# EAGLE schematic lul (EAGLE 9.6.1)
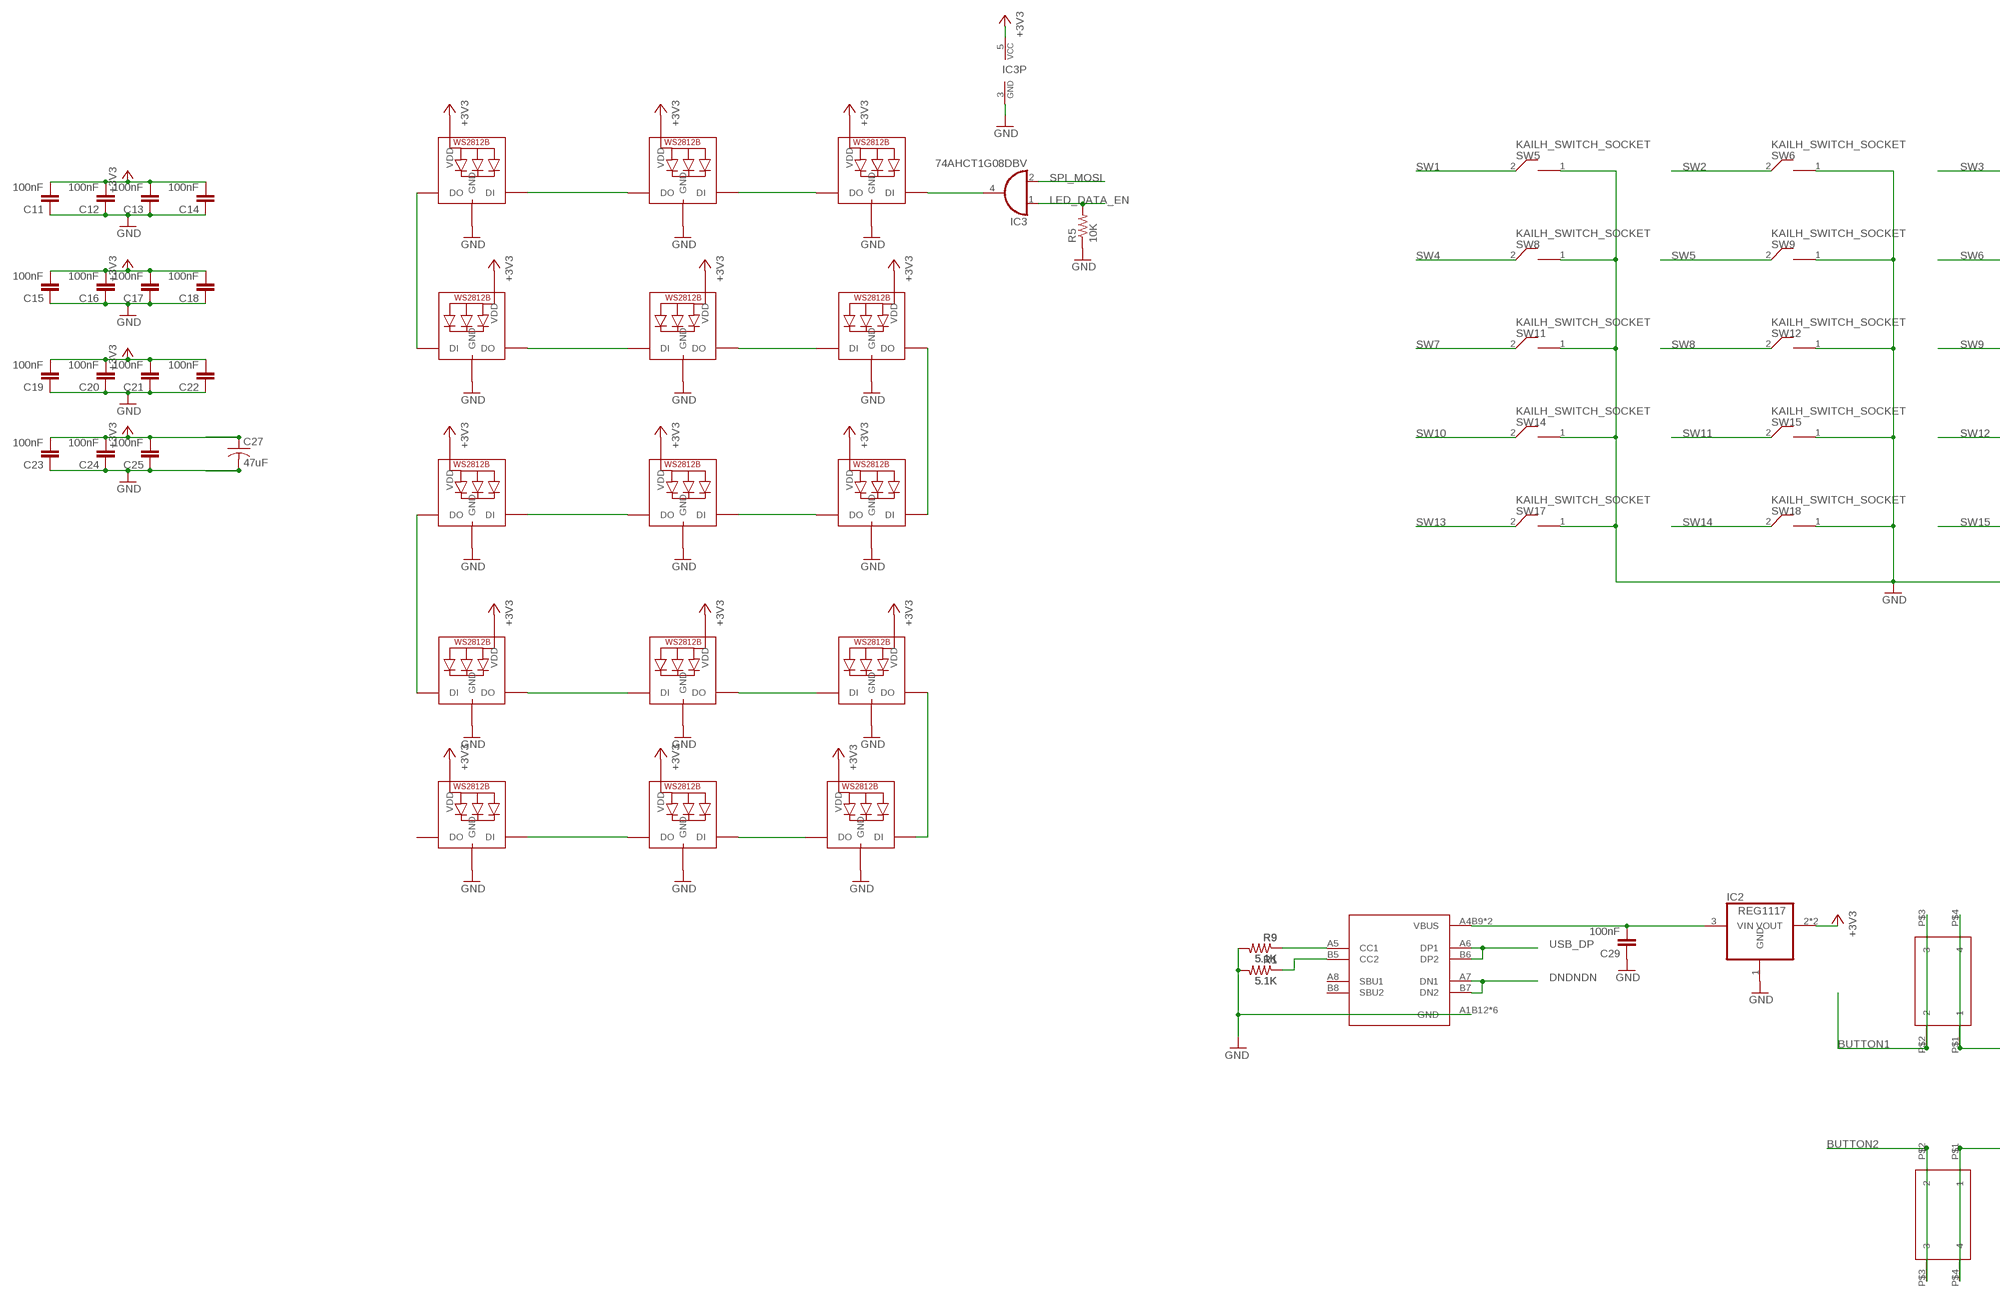
[diagram p0: schematic, sheet 1, part 1 of 2]
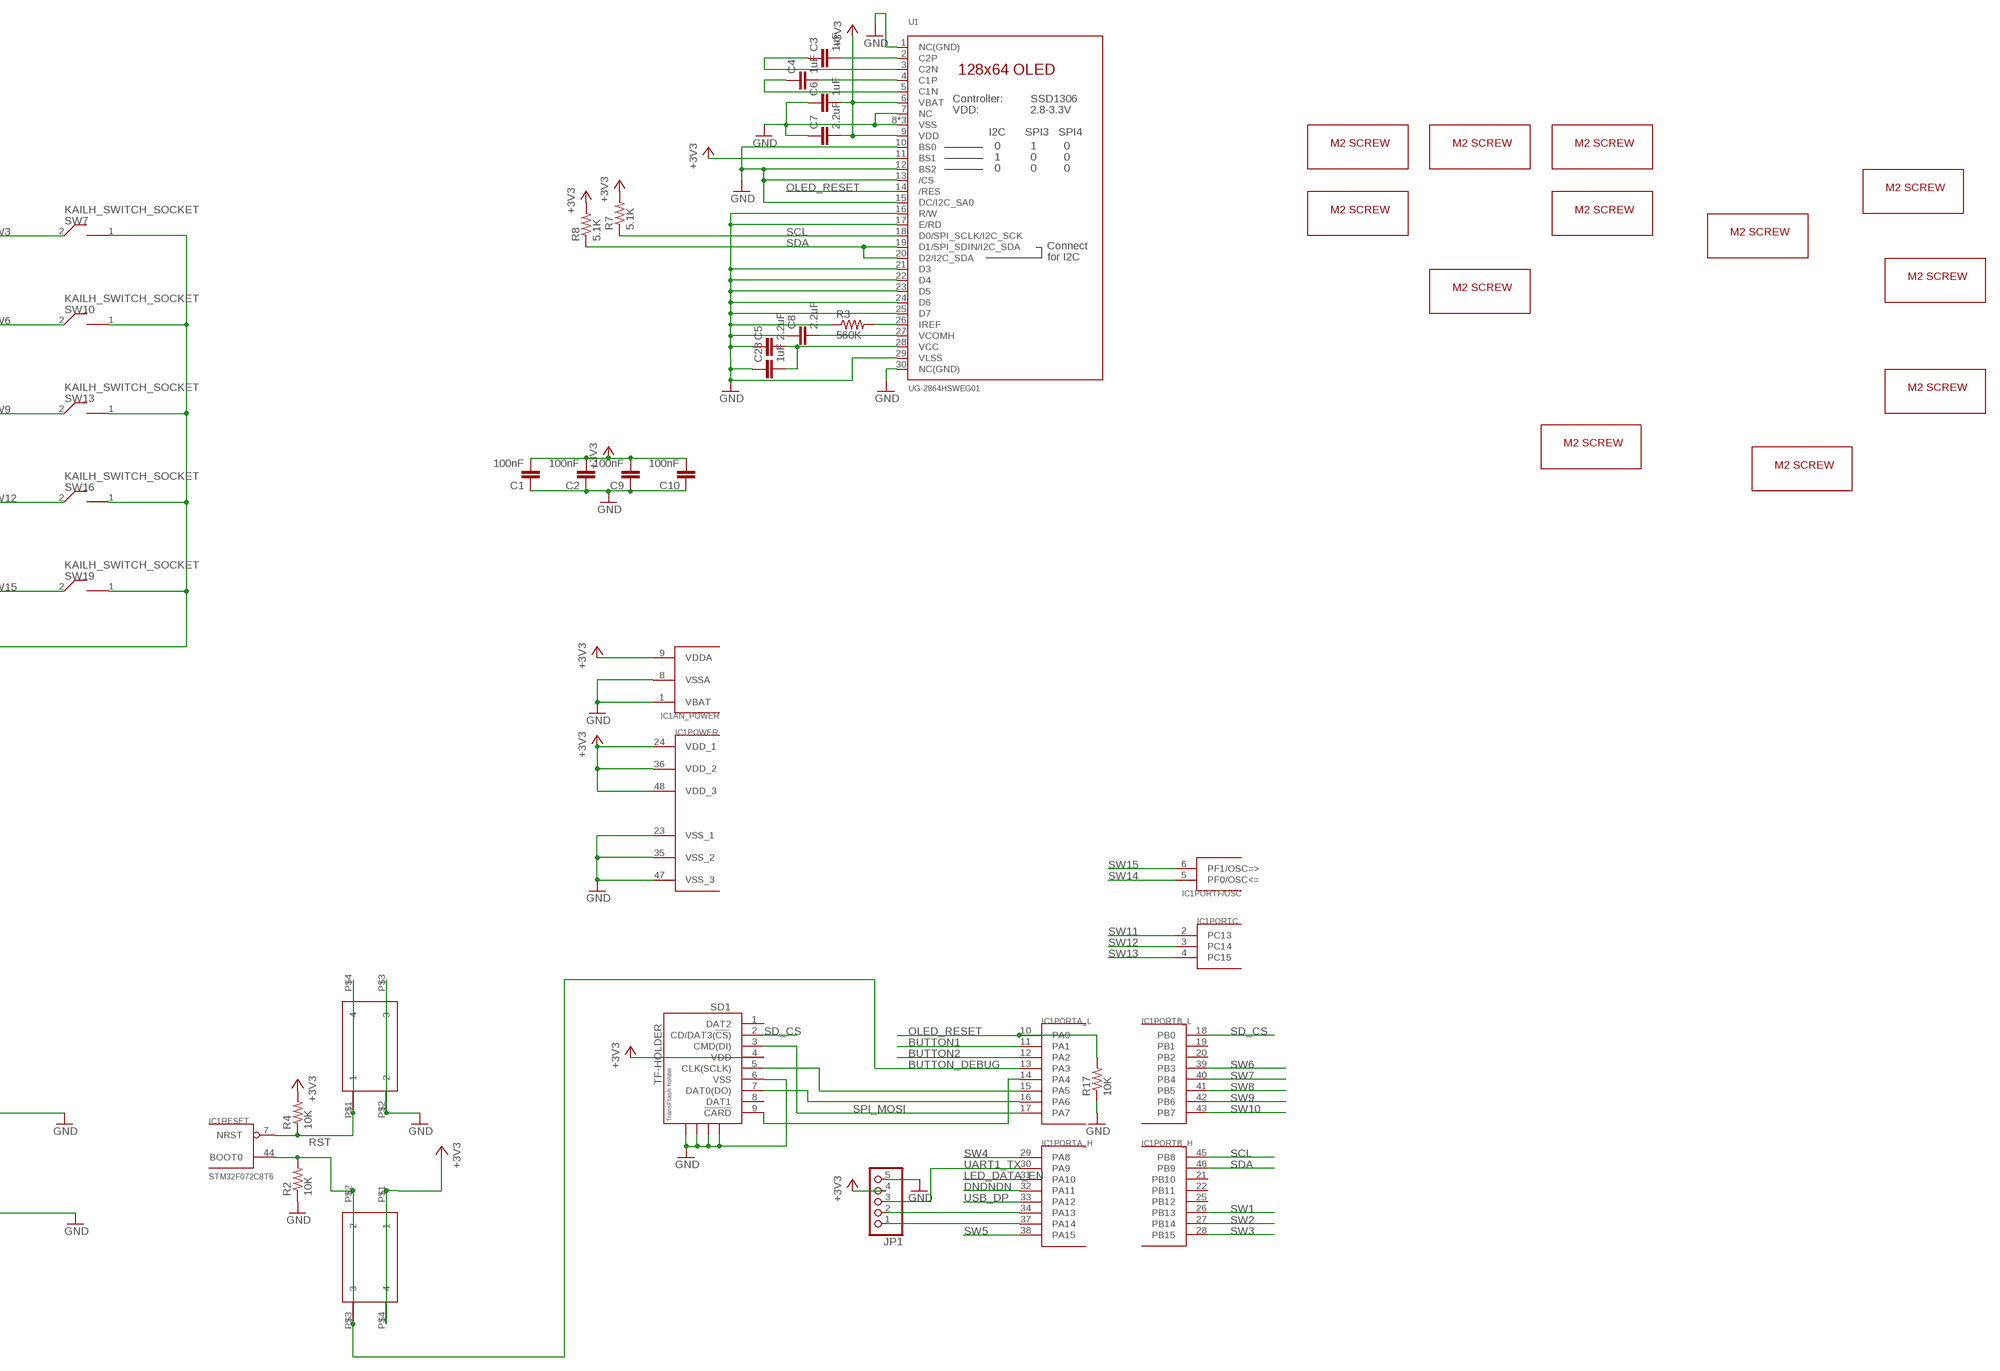
[diagram p1: schematic, sheet 1, part 2 of 2]

## Parts
C1  100nF  CAP0805  [0805@1]
C2  100nF  CAP0805  [0805@1]
C3  1uF  CAP0805  [0805@1]
C4  1uF  CAP0805  [0805@1]
C5  2.2uF  CAP0805  [0805@1]
C6  1uF  CAP0805  [0805@1]
C7  2.2uF  CAP0805  [0805@1]
C8  2.2uF  CAP0805  [0805@1]
C9  100nF  CAP0805  [0805@1]
C10  100nF  CAP0805  [0805@1]
C11  100nF  CAP0805  [0805@1]
C12  100nF  CAP0805  [0805@1]
C13  100nF  CAP0805  [0805@1]
C14  100nF  CAP0805  [0805@1]
C15  100nF  CAP0805  [0805@1]
C16  100nF  CAP0805  [0805@1]
C17  100nF  CAP0805  [0805@1]
C18  100nF  CAP0805  [0805@1]
C19  100nF  CAP0805  [0805@1]
C20  100nF  CAP0805  [0805@1]
C21  100nF  CAP0805  [0805@1]
C22  100nF  CAP0805  [0805@1]
C23  100nF  CAP0805  [0805@1]
C24  100nF  CAP0805  [0805@1]
C25  100nF  CAP0805  [0805@1]
C27  47uF  C-USC1210  [C1210]
C28  1uF  CAP0805  [0805@1]
C29  100nF  CAP0805  [0805@1]
IC1  STM32F072C8T6  [TQFP48]
IC2  REG1117  [SOT223]
IC3  74AHCT1G08DBV  [SOT23-5]
JP1  PINHD-1X5  [1X05]
LED1  WS2812B  [REVERSE_MNT]
LED2  WS2812B  [REVERSE_MNT]
LED3  WS2812B  [REVERSE_MNT]
LED4  WS2812B  [REVERSE_MNT]
LED5  WS2812B  [REVERSE_MNT]
LED6  WS2812B  [REVERSE_MNT]
LED7  WS2812B  [REVERSE_MNT]
LED8  WS2812B  [REVERSE_MNT]
LED9  WS2812B  [REVERSE_MNT]
LED10  WS2812B  [REVERSE_MNT]
LED11  WS2812B  [REVERSE_MNT]
LED12  WS2812B  [REVERSE_MNT]
LED13  WS2812B  [REVERSE_MNT]
LED14  WS2812B  [REVERSE_MNT]
LED15  WS2812B  [REVERSE_MNT]
R1  5.1K  RESISTOR0805-RES  [0805]
R2  10K  RESISTOR0805-RES  [0805]
R3  560K  RESISTOR0805-RES  [0805]
R4  10K  RESISTOR0805-RES  [0805]
R5  10K  RESISTOR0805-RES  [0805]
R7  5.1K  RESISTOR0805-RES  [0805]
R8  5.1K  RESISTOR0805-RES  [0805]
R9  5.1K  RESISTOR0805-RES  [0805]
R17  10K  RESISTOR0805-RES  [0805]
SD1  TF-HOLDER  [TF-PULL]
SW1  324_SW324_SWITCH_FOOT_HOLE  [342_SWICH_FOOT_HOLE]
SW2  324_SW324_SWITCH_FOOT_HOLE  [342_SWICH_FOOT_HOLE]
SW3  324_SW  [342_SWICH_FOOT]
SW4  324_SW  [342_SWICH_FOOT]
SW5  KAILH_SWITCH_SOCKET  [SWITCH_SOCKET]
SW6  KAILH_SWITCH_SOCKET  [SWITCH_SOCKET]
SW7  KAILH_SWITCH_SOCKET  [SWITCH_SOCKET]
SW8  KAILH_SWITCH_SOCKET  [SWITCH_SOCKET]
SW9  KAILH_SWITCH_SOCKET  [SWITCH_SOCKET]
SW10  KAILH_SWITCH_SOCKET  [SWITCH_SOCKET]
SW11  KAILH_SWITCH_SOCKET  [SWITCH_SOCKET]
SW12  KAILH_SWITCH_SOCKET  [SWITCH_SOCKET]
SW13  KAILH_SWITCH_SOCKET  [SWITCH_SOCKET]
SW14  KAILH_SWITCH_SOCKET  [SWITCH_SOCKET]
SW15  KAILH_SWITCH_SOCKET  [SWITCH_SOCKET]
SW16  KAILH_SWITCH_SOCKET  [SWITCH_SOCKET]
SW17  KAILH_SWITCH_SOCKET  [SWITCH_SOCKET]
SW18  KAILH_SWITCH_SOCKET  [SWITCH_SOCKET]
SW19  KAILH_SWITCH_SOCKET  [SWITCH_SOCKET]
U1  UG-2864HSWEG01  LUL_DISP_OLED_UG-2864HSWEG01  [LUL_UG-2864HSWEG01_1.3_WRAPAROUND]
U2  USBC_16P  [USBC_16P_FOOT]
U$7  M2_SCREW_DEV  [M2_SCREW_FOOT]
U$8  M2_SCREW_DEV  [M2_SCREW_FOOT]
U$9  M2_SCREW_DEV  [M2_SCREW_FOOT]
U$10  M2_SCREW_DEV  [M2_SCREW_FOOT]
U$11  M2_SCREW_DEV  [M2_SCREW_FOOT]
U$12  M2_SCREW_DEV  [M2_SCREW_FOOT]
U$13  M2_SCREW_DEV  [M2_SCREW_FOOT]
U$14  M2_SCREW_DEV  [M2_SCREW_FOOT]
U$15  M2_SCREW_DEV  [M2_SCREW_FOOT]
U$16  M2_SCREW_DEV  [M2_SCREW_FOOT]
U$17  M2_SCREW_DEV  [M2_SCREW_FOOT]
U$23  M2_SCREW_DEV  [M2_SCREW_FOOT]

## Nets
+3V3: C1.2 C2.2 C6.2 C7.2 C9.2 C10.2 C11.2 C12.2 C13.2 C14.2 C15.2 C16.2 C17.2 C18.2 C19.2 C20.2 C21.2 C22.2 C23.2 C24.2 C25.2 C27.1 IC1.9(AN_POWER:VDDA) IC1.24(POWER:VDD_1) IC1.36(POWER:VDD_2) IC1.48(POWER:VDD_3) IC2.2(VOUT) IC2.4(VOUT) IC3.5(VCC) JP1.4 LED1.VDD LED2.VDD LED3.VDD LED4.VDD LED5.VDD LED6.VDD LED7.VDD LED8.VDD LED9.VDD LED10.VDD LED11.VDD LED12.VDD LED13.VDD LED14.VDD LED15.VDD R4.2 R7.2 R8.2 SD1.4(VDD) SW1.P$1 SW1.P$4 U1.6(VBAT) U1.9(VDD) U1.11(BS1)
BUTTON1: IC1.11(PORTA_L:PA1) SW3.P$2 SW3.P$3
BUTTON2: IC1.12(PORTA_L:PA2) SW4.P$2 SW4.P$3
BUTTON_DEBUG: IC1.13(PORTA_L:PA3) IC1.44(RESET:BOOT0) R2.2 SW1.P$2 SW1.P$3
DNDNDN: IC1.32(PORTA_H:PA11) U2.A7(DN1) U2.B7(DN2)
GND: C1.1 C2.1 C5.1 C6.1 C7.1 C8.1 C9.1 C10.1 C11.1 C12.1 C13.1 C14.1 C15.1 C16.1 C17.1 C18.1 C19.1 C20.1 C21.1 C22.1 C23.1 C24.1 C25.1 C27.2 C28.1 C29.1 IC1.1(AN_POWER:VBAT) IC1.8(AN_POWER:VSSA) IC1.23(POWER:VSS_1) IC1.35(POWER:VSS_2) IC1.47(POWER:VSS_3) IC2.1(GND) IC3.3(GND) JP1.5 LED1.GND LED2.GND LED3.GND LED4.GND LED5.GND LED6.GND LED7.GND LED8.GND LED9.GND LED10.GND LED11.GND LED12.GND LED13.GND LED14.GND LED15.GND R1.2 R2.1 R3.1 R5.1 R9.2 R17.1 SD1.6(VSS) SD1.S1 SD1.S2 SD1.S3 SD1.S4 SW2.P$2 SW2.P$3 SW3.P$1 SW3.P$4 SW4.P$1 SW4.P$4 SW5.1 SW6.1 SW7.1 SW8.1 SW9.1 SW10.1 SW11.1 SW12.1 SW13.1 SW14.1 SW15.1 SW16.1 SW17.1 SW18.1 SW19.1 U1.1(NC(GND)) U1.7(NC) U1.8(VSS) U1.10(BS0) U1.12(BS2) U1.13(/CS) U1.15(DC/I2C_SA0) U1.16(R/W) U1.17(E/RD) U1.21(D3) U1.22(D4) U1.23(D5) U1.24(D6) U1.25(D7) U1.29(VLSS) U1.30(NC(GND)) U1.31(VSS) U1.32(VSS) U2.A1B12(GND) U2.B11A12(GND) U2.P$13(GND) U2.P$14(GND) U2.P$15(GND) U2.P$16(GND)
LED_DATA_EN: IC1.31(PORTA_H:PA10) IC3.1(I0) R5.2
N$1: C29.2 IC2.3(VIN) U2.A4B9(VBUS) U2.B4A9(VBUS)
N$3: R3.2 U1.26(IREF)
N$4: C3.2 U1.2(C2P)
N$5: C3.1 U1.3(C2N)
N$6: C4.2 U1.4(C1P)
N$7: C4.1 U1.5(C1N)
N$8: IC1.15(PORTA_L:PA5) SD1.5(CLK(SCLK))
N$9: LED2.DIN(DI) LED3.DOUT(DO)
N$10: IC1.16(PORTA_L:PA6) SD1.7(DAT0(DO))
N$11: C5.2 C28.2 U1.28(VCC)
N$12: C8.2 U1.27(VCOMH)
N$14: IC1.14(PORTA_L:PA4) SD1.9(!CARD)
N$15: LED1.DIN(DI) LED2.DOUT(DO)
N$17: LED1.DOUT(DO) LED4.DIN(DI)
N$18: LED4.DOUT(DO) LED5.DIN(DI)
N$19: LED5.DOUT(DO) LED6.DIN(DI)
N$20: LED6.DOUT(DO) LED9.DIN(DI)
N$21: LED8.DIN(DI) LED9.DOUT(DO)
N$22: LED7.DIN(DI) LED8.DOUT(DO)
N$23: LED7.DOUT(DO) LED10.DIN(DI)
N$24: LED10.DOUT(DO) LED11.DIN(DI)
N$25: LED11.DOUT(DO) LED12.DIN(DI)
N$26: LED12.DOUT(DO) LED15.DIN(DI)
N$27: LED14.DIN(DI) LED15.DOUT(DO)
N$28: LED13.DIN(DI) LED14.DOUT(DO)
N$29: IC3.4(O) LED3.DIN(DI)
N$31: R1.1 U2.B5(CC2)
N$32: IC1.37(PORTA_H:PA14) JP1.1
N$33: R9.1 U2.A5(CC1)
N$34: IC1.34(PORTA_H:PA13) JP1.2
OLED_RESET: IC1.10(PORTA_L:PA0) R17.2 U1.14(/RES)
RST: IC1.7(RESET:NRST) R4.1 SW2.P$1 SW2.P$4
SCL: IC1.45(PORTB_H:PB8) R7.1 U1.18(D0/SPI_SCLK/I2C_SCK)
SD_CS: IC1.18(PORTB_L:PB0) SD1.2(CD/DAT3(!CS!))
SDA: IC1.46(PORTB_H:PB9) R8.1 U1.19(D1/SPI_SDIN/I2C_SDA) U1.20(D2/I2C_SDA)
SPI_MOSI: IC1.17(PORTA_L:PA7) IC3.2(I1) SD1.3(CMD(DI))
SW1: IC1.26(PORTB_H:PB13) SW5.2
SW2: IC1.27(PORTB_H:PB14) SW6.2
SW3: IC1.28(PORTB_H:PB15) SW7.2
SW4: IC1.29(PORTA_H:PA8) SW8.2
SW5: IC1.38(PORTA_H:PA15) SW9.2
SW6: IC1.39(PORTB_L:PB3) SW10.2
SW7: IC1.40(PORTB_L:PB4) SW11.2
SW8: IC1.41(PORTB_L:PB5) SW12.2
SW9: IC1.42(PORTB_L:PB6) SW13.2
SW10: IC1.43(PORTB_L:PB7) SW14.2
SW11: IC1.2(PORTC:PC13) SW15.2
SW12: IC1.3(PORTC:PC14) SW16.2
SW13: IC1.4(PORTC:PC15) SW17.2
SW14: IC1.5(PORTF/OSC:PF0/OSC<=) SW18.2
SW15: IC1.6(PORTF/OSC:PF1/OSC=>) SW19.2
UART1_TX: IC1.30(PORTA_H:PA9) JP1.3
USB_DP: IC1.33(PORTA_H:PA12) U2.A6(DP1) U2.B6(DP2)
Unconnected: IC1.19(PORTB_L:PB1) IC1.20(PORTB_L:PB2) IC1.21(PORTB_H:PB10) IC1.22(PORTB_H:PB11) IC1.25(PORTB_H:PB12) LED13.DOUT(DO) SD1.1(DAT2) SD1.8(DAT1) U2.A8(SBU1) U2.B8(SBU2)

## Library data of the parts
C1-C25 C28 C29 = clock:CAP: Capacitor Standard 0603 ceramic capacitor, and 0.1" leaded capacitor.
C27 = clock:C-US: CAPACITOR, American symbol
IC1 = clock:STM32F072C8T6: ST STM32F072 48pin LQFP
IC2 = clock:REG1117: 800mA and 1A Low Dropout (LDO) Positive Regulator 1.8V, 2.5V, 2.85V, 3.3V, 5V, and Adj; MPN: REG1117; OC_FARNELL: 1097566; OC_NEWARK: 14P6981
IC3 = 74xx-little-de:74*1G08: 2-input AND gate
JP1 = pinhead:PINHD-1X5: PIN HEADER
LED1-LED15 = lul:WS2812B
R1 R9 = joyAnalog:RESISTOR: Resistor Basic schematic elements and footprints for 0603, 1206, and PTH resistors.
R2-R5 R7 R8 R17 = clock:RESISTOR: Resistor Basic schematic elements and footprints for 0603, 1206, and PTH resistors.
SD1 = clock:TF-HOLDER: TF / Micro SD socket is PUSH-PUSH type, the card can be pushed into and auto locked and pushed out by simply press the card. Surface Mounting type.
SW1 SW2 = 3pos_slide_switch:324_SW
SW3 SW4 = 3pos_slide_switch_centered:324_SW
SW5-SW19 = Kailh_switch_socket:KAILH_SWITCH_SOCKET
U1 = lul:LUL_DISP_OLED_UG-2864HSWEG01: UG-2864HSWEG01 OLED display Both 1.3" and 0.96" models share the same FPC tab footprint, only the screen dimensions vary.
U2 = my_usbc_16p:USBC_16P
U$7-U$17 U$23 = 3pos_slide_switch_centered:M2_SCREW_DEV